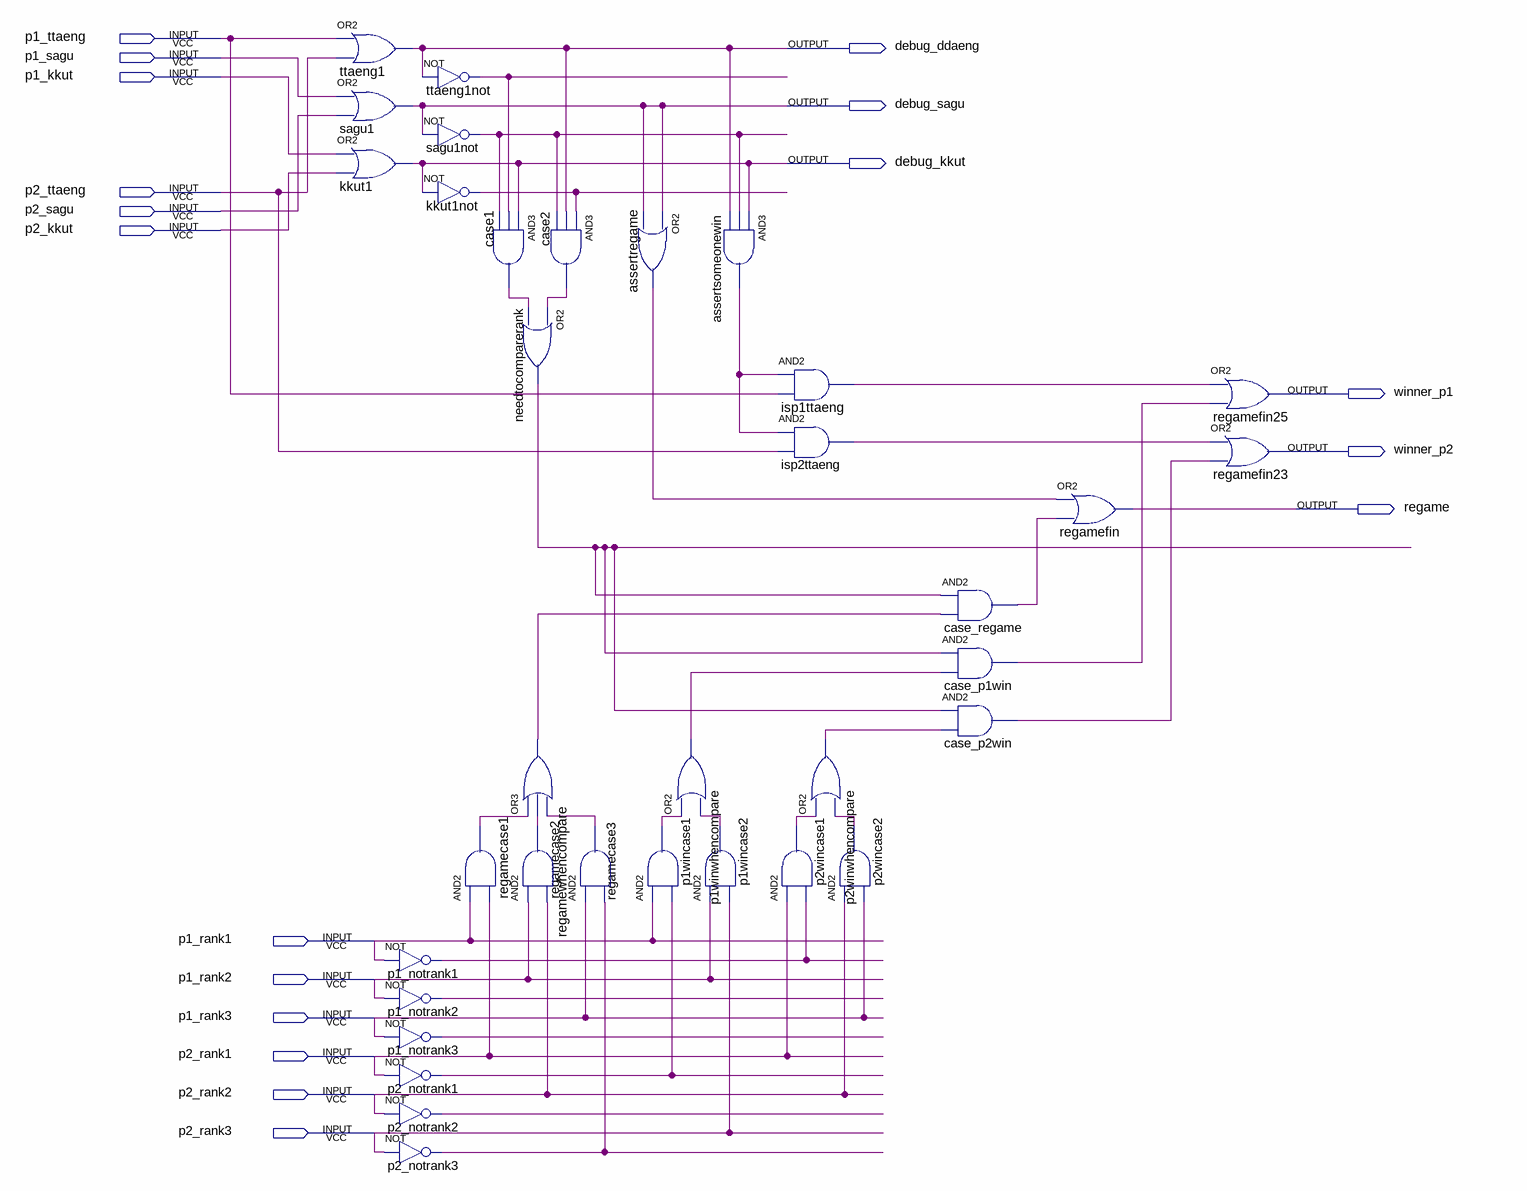
[diagram p0: schematic sheet]
// Quartus schematic playercardcomparer.bdf as structural Verilog: 35 symbols, 18 pins
module playercardcomparer (
  input  p1_ttaeng,
  input  p1_sagu,
  input  p1_kkut,
  input  p2_ttaeng,
  input  p2_sagu,
  input  p2_kkut,
  input  p1_rank1,
  input  p1_rank2,
  input  p1_rank3,
  input  p2_rank1,
  input  p2_rank2,
  input  p2_rank3,
  output debug_ddaeng,
  output debug_sagu,
  output debug_kkut,
  output winner_p1,
  output winner_p2,
  output regame
);

  wire assertregame_out, assertsomeonewin_out, case1_out, case2_out, case_p1win_out, case_p2win_out,
       case_regame_out, isp1ttaeng_out, isp2ttaeng_out, kkut1not_out, needtocomparerank_out, p1_notrank1_out,
       p1_notrank2_out, p1_notrank3_out, p1wincase1_out, p1wincase2_out, p1winwhencompare_out,
       p2_notrank1_out, p2_notrank2_out, p2_notrank3_out, p2wincase1_out, p2wincase2_out,
       p2winwhencompare_out, regamecase1_out, regamecase2_out, regamecase3_out, regamewhencompare_out,
       sagu1not_out, ttaeng1not_out;

  or ttaeng1 (debug_ddaeng, p1_ttaeng, p2_ttaeng);
  or sagu1 (debug_sagu, p1_sagu, p2_sagu);
  or kkut1 (debug_kkut, p1_kkut, p2_kkut);
  not ttaeng1not (ttaeng1not_out, debug_ddaeng);
  not sagu1not (sagu1not_out, debug_sagu);
  not kkut1not (kkut1not_out, debug_kkut);
  and regamecase1 (regamecase1_out, p1_rank1, p2_rank1);
  not p1_notrank1 (p1_notrank1_out, p1_rank1);
  not p1_notrank2 (p1_notrank2_out, p1_rank2);
  not p1_notrank3 (p1_notrank3_out, p1_rank3);
  not p2_notrank1 (p2_notrank1_out, p2_rank1);
  not p2_notrank2 (p2_notrank2_out, p2_rank2);
  not p2_notrank3 (p2_notrank3_out, p2_rank3);
  and case1 (case1_out, debug_kkut, ttaeng1not_out, sagu1not_out);
  or needtocomparerank (needtocomparerank_out, case2_out, case1_out);
  or regamewhencompare (regamewhencompare_out, regamecase1_out, regamecase2_out, regamecase3_out);
  and regamecase2 (regamecase2_out, p1_rank2, p2_rank2);
  and case2 (case2_out, kkut1not_out, debug_ddaeng, sagu1not_out);
  and regamecase3 (regamecase3_out, p1_rank3, p2_notrank3_out);
  or assertregame (assertregame_out, debug_sagu, debug_sagu);
  or p1winwhencompare (p1winwhencompare_out, p1wincase1_out, p1wincase2_out);
  and p1wincase1 (p1wincase1_out, p1_rank1, p2_notrank1_out);
  and assertsomeonewin (assertsomeonewin_out, debug_kkut, sagu1not_out, debug_ddaeng);
  and p1wincase2 (p1wincase2_out, p1_rank2, p2_rank3);
  and isp1ttaeng (isp1ttaeng_out, assertsomeonewin_out, p1_ttaeng);
  and isp2ttaeng (isp2ttaeng_out, assertsomeonewin_out, p2_ttaeng);
  or p2winwhencompare (p2winwhencompare_out, p2wincase1_out, p2wincase2_out);
  and p2wincase1 (p2wincase1_out, p2_rank1, p1_notrank1_out);
  and p2wincase2 (p2wincase2_out, p2_rank2, p1_rank3);
  and case_regame (case_regame_out, needtocomparerank_out, regamewhencompare_out);
  and case_p1win (case_p1win_out, needtocomparerank_out, p1winwhencompare_out);
  and case_p2win (case_p2win_out, needtocomparerank_out, p2winwhencompare_out);
  or regamefin (regame, assertregame_out, case_regame_out);
  or regamefin25 (winner_p1, isp1ttaeng_out, case_p1win_out);
  or regamefin23 (winner_p2, isp2ttaeng_out, case_p2win_out);
endmodule
